# Altium schematic sheet Analog.SchDoc: Analog: entrada x7.8 (PA0) + salida PWM filtrada (PB0), MCP6004 a 3.3 V
size A4; Author: Efrain Alvarado; CompanyName: Universidad de Cuenca - MCIE; DrawnBy: Efrain Alvarado; DocumentNumber: E08-A; Revision: 1.0; SheetNumber: 1; SheetTotal: 1
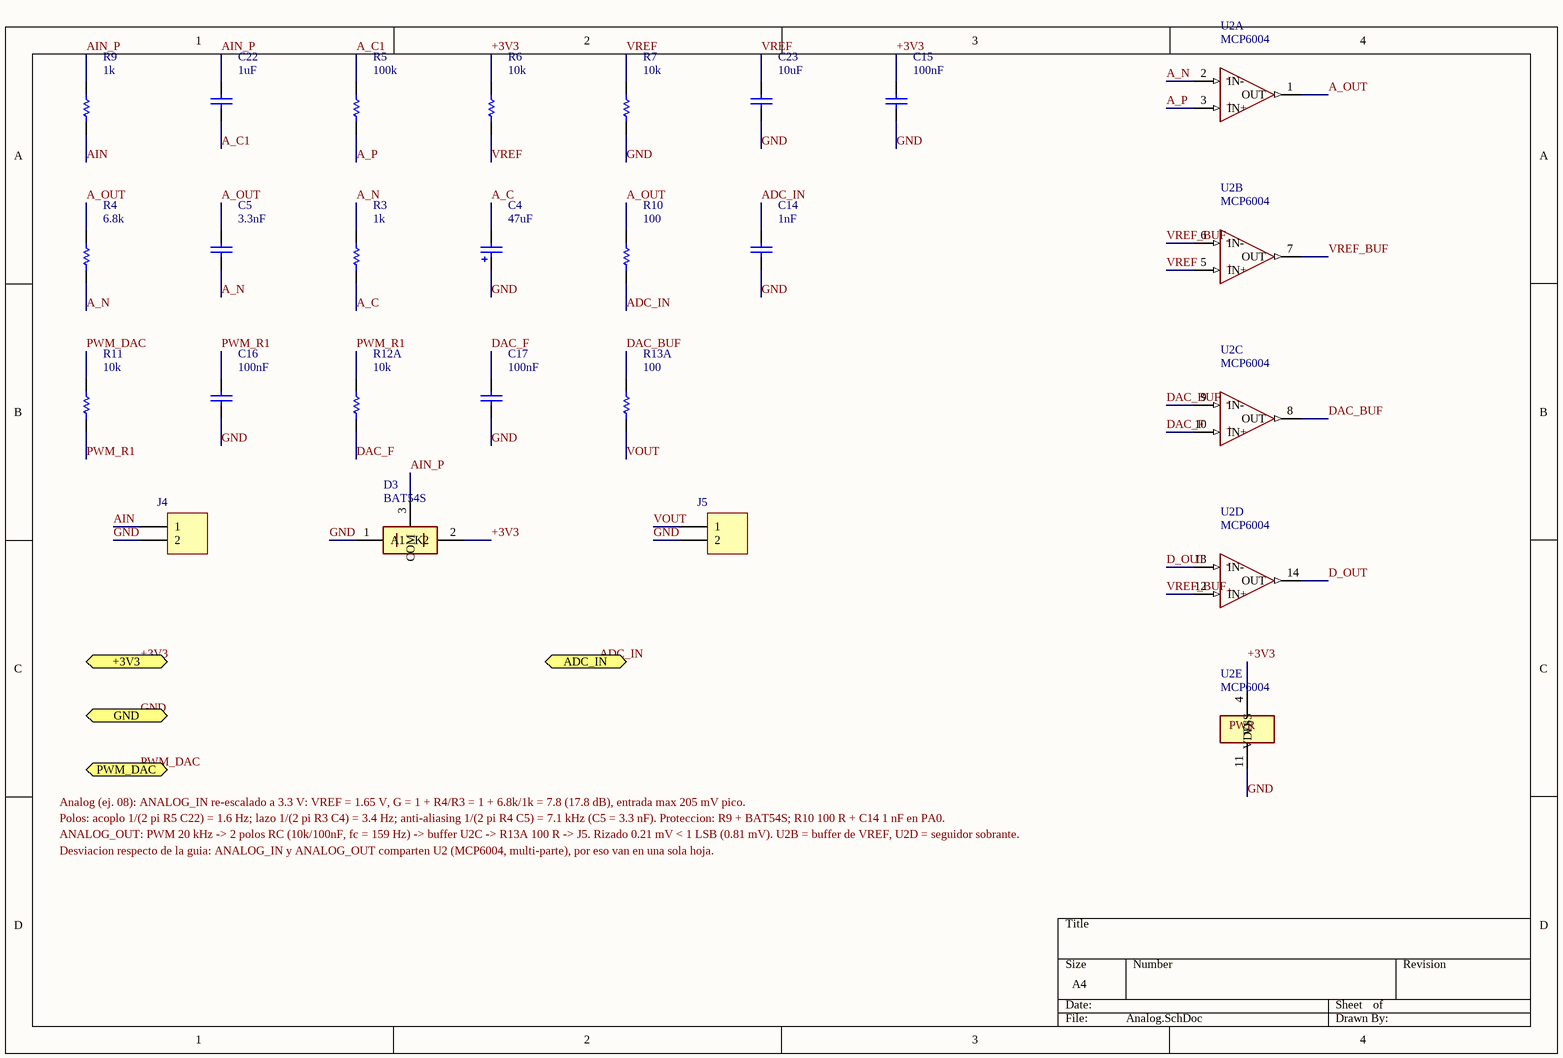
[diagram p0: Analog.SchDoc]

## Parts
C4  value 47uF  [RB5-10.5]  (hidden comment: Cap Pol1)
C5  value 3.3nF  [0603]  (hidden comment: Cap)
C14  value 1nF  [0603]  (hidden comment: Cap)
C15  value 100nF  [0603]  (hidden comment: Cap)
C16  value 100nF  [0603]  (hidden comment: Cap)
C17  value 100nF  [0603]  (hidden comment: Cap)
C22  value 1uF  [0603]  (hidden comment: Cap)
C23  value 10uF  [C0805]  (hidden comment: Cap)
D3  BAT54S  [SOT-23_N]
J4  Header 2  [HDR1X2]  (value not drawn)
J5  Header 2  [HDR1X2]  (value not drawn)
R3  value 1k  [0603]  (hidden comment: Res1)
R4  value 6.8k  [0603]  (hidden comment: Res1)
R5  value 100k  [0603]  (hidden comment: Res1)
R6  value 10k  [0603]  (hidden comment: Res1)
R7  value 10k  [0603]  (hidden comment: Res1)
R9  value 1k  [0603]  (hidden comment: Res1)
R10  value 100  [0603]  (hidden comment: Res1)
R11  value 10k  [0603]  (hidden comment: Res1)
R12A  value 10k  [0603]  (hidden comment: Res1)
R13A  value 100  [0603]  (hidden comment: Res1)
U2  MCP6004  [DIP-14]  (parts A,B,C,D,E of 5)

## Ports
+3V3, ADC_IN, GND, PWM_DAC

## Nets
+3V3: C15.2 D3.2(K2) R6.2 U2.4(VDD) ; port +3V3
A_C: C4.2 R3.1
A_C1: C22.1 R5.2
A_N: C5.1 R3.2 R4.1 U2.2(IN-)
A_OUT: C5.2 R4.2 R10.2 U2.1(OUT)
A_P: R5.1 U2.3(IN+)
ADC_IN: C14.2 R10.1 ; port ADC_IN
AIN: J4.1 R9.1
AIN_P: C22.2 D3.3(COM) R9.2
D_OUT: U2.13(IN-) U2.14(OUT)
DAC_BUF: R13A.2 U2.8(OUT) U2.9(IN-)
DAC_F: C17.2 R12A.1 U2.10(IN+)
GND: C4.1 C14.1 C15.1 C16.1 C17.1 C23.1 D3.1(A1) J4.2 J5.2 R7.1 U2.11(VSS) ; port GND
PWM_DAC: R11.2 ; port PWM_DAC
PWM_R1: C16.2 R11.1 R12A.2
VOUT: J5.1 R13A.1
VREF: C23.2 R6.1 R7.2 U2.5(IN+)
VREF_BUF: U2.6(IN-) U2.7(OUT) U2.12(IN+)

## Notes on the sheet
- Analog (ej. 08): ANALOG_IN re-escalado a 3.3 V: VREF = 1.65 V, G = 1 + R4/R3 = 1 + 6.8k/1k = 7.8 (17.8 dB), entrada max 205 mV pico.
- Polos: acoplo 1/(2 pi R5 C22) = 1.6 Hz; lazo 1/(2 pi R3 C4) = 3.4 Hz; anti-aliasing 1/(2 pi R4 C5) = 7.1 kHz (C5 = 3.3 nF). Proteccion: R9 + BAT54S; R10 100 R + C14 1 nF en PA0.
- ANALOG_OUT: PWM 20 kHz -> 2 polos RC (10k/100nF, fc = 159 Hz) -> buffer U2C -> R13A 100 R -> J5. Rizado 0.21 mV < 1 LSB (0.81 mV). U2B = buffer de VREF, U2D = seguidor sobrante.
- Desviacion respecto de la guia: ANALOG_IN y ANALOG_OUT comparten U2 (MCP6004, multi-parte), por eso van en una sola hoja.
- (in symbol MCP6004, part A) -; +
- (in symbol MCP6004, part B) -; +
- (in symbol MCP6004, part C) -; +
- (in symbol MCP6004, part D) -; +
- (in symbol MCP6004, part E) PWR

## Library data of the parts
C4 = Cap Pol1: Electrolitico 47 uF 16 V (polo del lazo 3.4 Hz); Manufacturer: Panasonic; Manufacturer Part Number: EEU-FR1C470; Published: 8-Jun-2000; LatestRevisionDate: 17-Jul-2002; LatestRevisionNote: Re-released for DXP Platform.; PackageReference: RB7.6-15; Publisher: Altium Limited; PackageDescription: Polarized Capacitor (Radial); 2 Leads
C5 = Cap: Capacitor 3.3nF; Manufacturer: KEMET; Manufacturer Part Number: C0603C3323.3nF; Published: 8-Jun-2000; LatestRevisionDate: 17-Jul-2002; LatestRevisionNote: Re-released for DXP Platform.; PackageReference: RAD-0.3; Publisher: Altium Limited; PackageDescription: Radial Cap, Thru-Hole; 2 Leads; 0.3 in Pin Spacing
C14 = Cap: Capacitor 1nF; Manufacturer: KEMET; Manufacturer Part Number: C0603C1021nF; Published: 8-Jun-2000; LatestRevisionDate: 17-Jul-2002; LatestRevisionNote: Re-released for DXP Platform.; PackageReference: RAD-0.3; Publisher: Altium Limited; PackageDescription: Radial Cap, Thru-Hole; 2 Leads; 0.3 in Pin Spacing
C15-C17 = Cap: Capacitor 100nF; Manufacturer: KEMET; Manufacturer Part Number: C0603C100nF; Published: 8-Jun-2000; LatestRevisionDate: 17-Jul-2002; LatestRevisionNote: Re-released for DXP Platform.; PackageReference: RAD-0.3; Publisher: Altium Limited; PackageDescription: Radial Cap, Thru-Hole; 2 Leads; 0.3 in Pin Spacing
C22 = Cap: Capacitor 1uF; Manufacturer: KEMET; Manufacturer Part Number: C0603C1051uF; Published: 8-Jun-2000; LatestRevisionDate: 17-Jul-2002; LatestRevisionNote: Re-released for DXP Platform.; PackageReference: RAD-0.3; Publisher: Altium Limited; PackageDescription: Radial Cap, Thru-Hole; 2 Leads; 0.3 in Pin Spacing
C23 = Cap: Capacitor 10uF; Manufacturer: KEMET; Manufacturer Part Number: C0805C10610uF; Published: 8-Jun-2000; LatestRevisionDate: 17-Jul-2002; LatestRevisionNote: Re-released for DXP Platform.; PackageReference: RAD-0.3; Publisher: Altium Limited; PackageDescription: Radial Cap, Thru-Hole; 2 Leads; 0.3 in Pin Spacing
D3 = BAT54S: Dual Schottky series pair SOT-23 (clamp); Manufacturer: Nexperia; Manufacturer Part Number: BAT54S
J4 = Header 2: Entrada analogica +-200 mV: pin1 senal, pin2 GND; Manufacturer: Generic; Manufacturer Part Number: Pin header 1x2; LatestRevisionDate: 17-Jul-2002; LatestRevisionNote: Re-released for DXP Platform.; Publisher: Altium Limited
J5 = Header 2: Salida analogica 0-3.3 V: pin1 VOUT, pin2 GND; Manufacturer: Generic; Manufacturer Part Number: Pin header 1x2; LatestRevisionDate: 17-Jul-2002; LatestRevisionNote: Re-released for DXP Platform.; Publisher: Altium Limited
R3 R9 = Res1: Resistor 1k 0603; Manufacturer: Yageo; Manufacturer Part Number: RC0603FR-071K; Published: 8-Jun-2000; LatestRevisionDate: 17-Jul-2002; LatestRevisionNote: Re-released for DXP Platform.; PackageReference: AXIAL-0.3; Publisher: Altium Limited; PackageDescription: Axial Device, Thru-Hole; 2 Leads; 0.3 in Pin Spacing
R4 = Res1: Resistor 6.8k 0603; Manufacturer: Yageo; Manufacturer Part Number: RC0603FR-076.8K; Published: 8-Jun-2000; LatestRevisionDate: 17-Jul-2002; LatestRevisionNote: Re-released for DXP Platform.; PackageReference: AXIAL-0.3; Publisher: Altium Limited; PackageDescription: Axial Device, Thru-Hole; 2 Leads; 0.3 in Pin Spacing
R5 = Res1: Resistor 100k 0603; Manufacturer: Yageo; Manufacturer Part Number: RC0603FR-07100K; Published: 8-Jun-2000; LatestRevisionDate: 17-Jul-2002; LatestRevisionNote: Re-released for DXP Platform.; PackageReference: AXIAL-0.3; Publisher: Altium Limited; PackageDescription: Axial Device, Thru-Hole; 2 Leads; 0.3 in Pin Spacing
R6 R7 R11 R12A = Res1: Resistor 10k 0603; Manufacturer: Yageo; Manufacturer Part Number: RC0603FR-0710K; Published: 8-Jun-2000; LatestRevisionDate: 17-Jul-2002; LatestRevisionNote: Re-released for DXP Platform.; PackageReference: AXIAL-0.3; Publisher: Altium Limited; PackageDescription: Axial Device, Thru-Hole; 2 Leads; 0.3 in Pin Spacing
R10 R13A = Res1: Resistor 100 0603; Manufacturer: Yageo; Manufacturer Part Number: RC0603FR-07100; Published: 8-Jun-2000; LatestRevisionDate: 17-Jul-2002; LatestRevisionNote: Re-released for DXP Platform.; PackageReference: AXIAL-0.3; Publisher: Altium Limited; PackageDescription: Axial Device, Thru-Hole; 2 Leads; 0.3 in Pin Spacing
U2 = MCP6004: MCP6004 quad op-amp rail-to-rail 1 MHz (A-D) + power part E, PDIP-14; Manufacturer: Microchip; Manufacturer Part Number: MCP6004-I/P